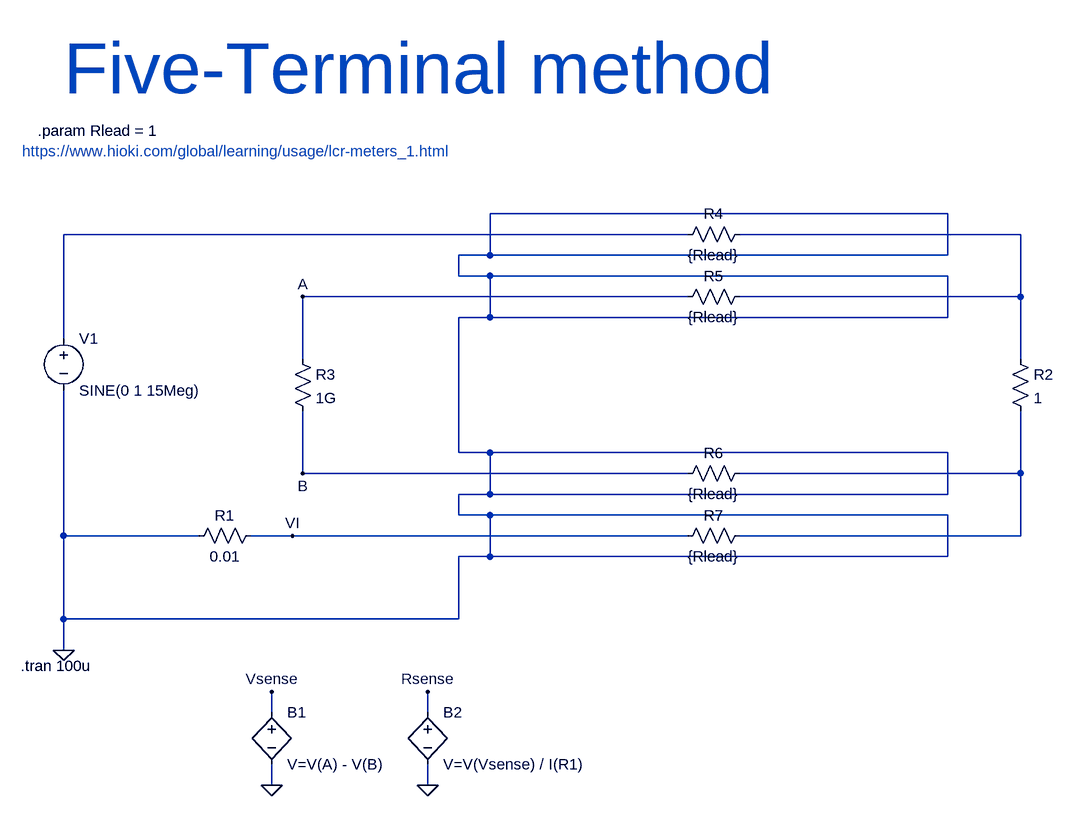
[diagram p0: schematic five-terminal_method.asc]
five-terminal_method.asc, the LTspice schematic file:
Version 4
SHEET 1 2136 1144
WIRE 1968 -96 1264 -96
WIRE 1568 -64 608 -64
WIRE 2080 -64 1648 -64
WIRE 1264 -32 1264 -96
WIRE 1264 -32 1216 -32
WIRE 1968 -32 1968 -96
WIRE 1968 -32 1264 -32
WIRE 1216 0 1216 -32
WIRE 1264 0 1216 0
WIRE 1968 0 1264 0
WIRE 1568 32 976 32
WIRE 2080 32 2080 -64
WIRE 2080 32 1648 32
WIRE 1264 64 1264 0
WIRE 1264 64 1216 64
WIRE 1968 64 1968 0
WIRE 1968 64 1264 64
WIRE 608 96 608 -64
WIRE 976 128 976 32
WIRE 2080 128 2080 32
WIRE 1216 272 1216 64
WIRE 1264 272 1216 272
WIRE 1968 272 1264 272
WIRE 976 304 976 208
WIRE 1568 304 976 304
WIRE 2080 304 2080 208
WIRE 2080 304 1648 304
WIRE 1264 336 1264 272
WIRE 1264 336 1216 336
WIRE 1968 336 1968 272
WIRE 1968 336 1264 336
WIRE 1216 368 1216 336
WIRE 1264 368 1216 368
WIRE 1968 368 1264 368
WIRE 608 400 608 176
WIRE 816 400 608 400
WIRE 960 400 896 400
WIRE 1568 400 960 400
WIRE 2080 400 2080 304
WIRE 2080 400 1648 400
WIRE 1264 432 1264 368
WIRE 1264 432 1216 432
WIRE 1968 432 1968 368
WIRE 1968 432 1264 432
WIRE 608 528 608 400
WIRE 1216 528 1216 432
WIRE 1216 528 608 528
WIRE 608 576 608 528
WIRE 928 672 928 640
WIRE 1168 672 1168 640
WIRE 928 784 928 752
WIRE 1168 784 1168 752
FLAG 608 576 0
FLAG 976 32 A
FLAG 976 304 B
FLAG 928 784 0
FLAG 928 640 Vsense
FLAG 960 400 VI
FLAG 1168 784 0
FLAG 1168 640 Rsense
SYMBOL voltage 608 80 R0
WINDOW 123 0 0 Left 0
WINDOW 39 0 0 Left 0
SYMATTR InstName V1
SYMATTR Value SINE(0 1 15Meg)
SYMBOL res 912 384 R90
WINDOW 0 0 56 VBottom 2
WINDOW 3 32 56 VTop 2
SYMATTR InstName R1
SYMATTR Value 0.01
SYMBOL res 2064 112 R0
SYMATTR InstName R2
SYMATTR Value 1
SYMBOL res 960 112 R0
SYMATTR InstName R3
SYMATTR Value 1G
SYMBOL res 1664 -80 R90
WINDOW 0 0 56 VBottom 2
WINDOW 3 32 56 VTop 2
SYMATTR InstName R4
SYMATTR Value {Rlead}
SYMBOL res 1664 16 R90
WINDOW 0 0 56 VBottom 2
WINDOW 3 32 56 VTop 2
SYMATTR InstName R5
SYMATTR Value {Rlead}
SYMBOL res 1664 288 R90
WINDOW 0 0 56 VBottom 2
WINDOW 3 32 56 VTop 2
SYMATTR InstName R6
SYMATTR Value {Rlead}
SYMBOL res 1664 384 R90
WINDOW 0 0 56 VBottom 2
WINDOW 3 32 56 VTop 2
SYMATTR InstName R7
SYMATTR Value {Rlead}
SYMBOL bv 928 656 R0
SYMATTR InstName B1
SYMATTR Value V=V(A) - V(B)
SYMBOL bv 1168 656 R0
SYMATTR InstName B2
SYMATTR Value V=V(Vsense) / I(R1)
TEXT 568 -224 Left 2 !.param Rlead = 1
TEXT 544 -192 Left 2 ;https://www.hioki.com/global/learning/usage/lcr-meters_1.html
TEXT 542 600 Left 2 !.tran 100u
TEXT 608 -320 Left 7 ;Five-Terminal method

The netlist it stands for:
* five-terminal_method.asc
V1 N001 0 SINE(0 1 15Meg)
R1 VI 0 0.01
R2 N002 N003 1
R3 A B 1G
R4 N002 N001 {Rlead}
R5 N002 A {Rlead}
R6 N003 B {Rlead}
R7 N003 VI {Rlead}
B1 Vsense 0 V=V(A) - V(B)
B2 Rsense 0 V=V(Vsense) / I(R1)
.param Rlead = 1
* https://www.hioki.com/global/learning/usage/lcr-meters_1.html
.tran 100u
* Five-Terminal method
.backanno
.end